# EAGLE schematic shield (EAGLE 6.4)
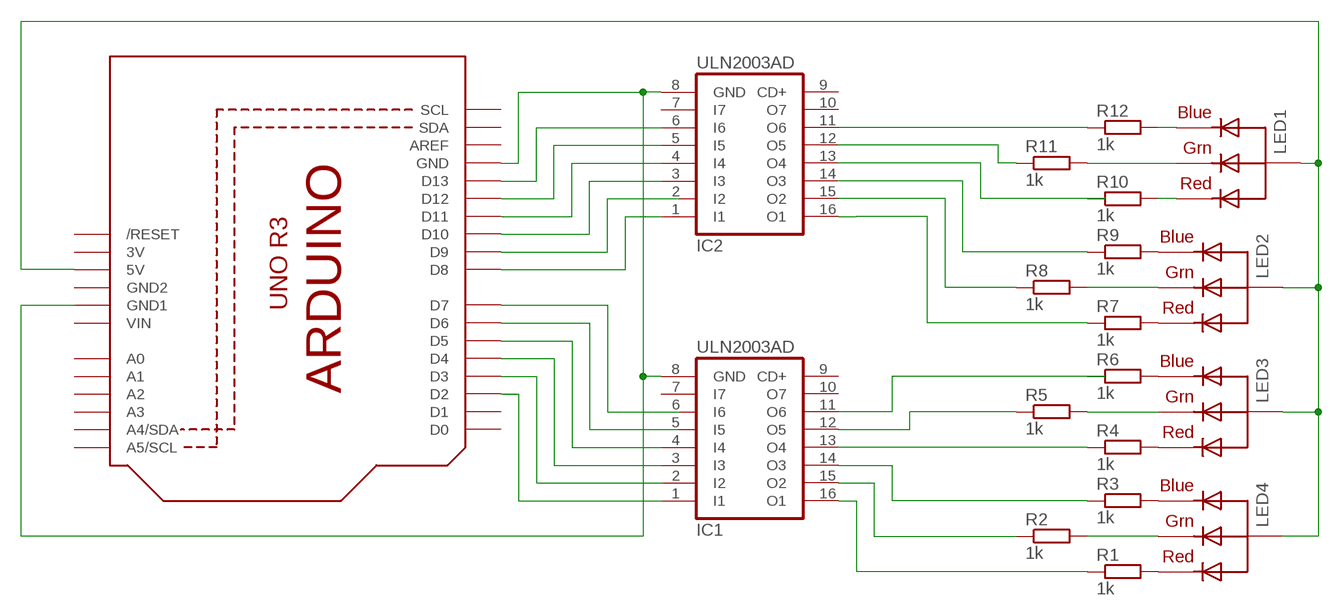
[diagram p0: schematic, sheet 1]

## Parts
IC1  ULN2003AD  [SO16]
IC2  ULN2003AD  [SO16]
LED1  RGBLED_CA-PIRANHA  [PIRANHA5MM]
LED2  RGBLED_CA-PIRANHA  [PIRANHA5MM]
LED3  RGBLED_CA-PIRANHA  [PIRANHA5MM]
LED4  RGBLED_CA-PIRANHA  [PIRANHA5MM]
Q1  ARDUINOR3-NOIOREF-NOTEXT  [ARDUINOR3-NOTEXT-NOIOREF]
R1  1k  R-EU_0204/7  [0204/7]
R2  1k  R-EU_0204/7  [0204/7]
R3  1k  R-EU_0204/7  [0204/7]
R4  1k  R-EU_0204/7  [0204/7]
R5  1k  R-EU_0204/7  [0204/7]
R6  1k  R-EU_0204/7  [0204/7]
R7  1k  R-EU_0204/7  [0204/7]
R8  1k  R-EU_0204/7  [0204/7]
R9  1k  R-EU_0204/7  [0204/7]
R10  1k  R-EU_0204/7  [0204/7]
R11  1k  R-EU_0204/7  [0204/7]
R12  1k  R-EU_0204/7  [0204/7]

## Nets
N$1: IC1.8(GND) IC2.8(GND) Q1.GND Q1.GND1
N$2: LED1.4(VCC) LED2.4(VCC) LED3.4(VCC) LED4.4(VCC) Q1.5V
N$3: LED4.2(RED) R1.2
N$4: LED4.1(BLUE) R3.2
N$5: LED3.3(GREEN) R5.2
N$6: LED2.2(RED) R7.2
N$7: LED2.1(BLUE) R9.2
N$8: LED1.2(RED) R10.2
N$9: LED1.1(BLUE) R12.2
N$10: LED3.1(BLUE) R6.2
N$11: LED3.2(RED) R4.2
N$12: LED2.3(GREEN) R8.2
N$13: LED1.3(GREEN) R11.2
N$14: LED4.3(GREEN) R2.2
N$15: IC1.16(O1) R1.1
N$16: IC1.15(O2) R2.1
N$17: IC1.14(O3) R3.1
N$18: IC1.13(O4) R4.1
N$19: IC1.12(O5) R5.1
N$20: IC1.11(O6)
N$21: IC1.1(I1) Q1.D2
N$22: IC2.12(O5) R11.1
N$23: IC2.13(O4)
N$24: IC2.14(O3) R9.1
N$25: IC2.11(O6) R12.1
N$26: IC2.15(O2) R8.1
N$27: IC2.16(O1) R7.1
N$28: Q1.D4
N$30: IC1.4(I4) Q1.D5
N$31: Q1.D6
N$32: Q1.D7
N$33: IC2.1(I1) Q1.D8
N$34: Q1.D9
N$35: IC2.3(I3) Q1.D10
N$36: IC2.4(I4) Q1.D11
N$37: IC2.5(I5) Q1.D12
N$38: IC2.6(I6) Q1.D13
N$39: IC1.2(I2) Q1.D3
Unconnected: IC1.3(I3) IC1.5(I5) IC1.6(I6) IC1.7(I7) IC1.9(CD+) IC1.10(O7) IC2.2(I2) IC2.7(I7) IC2.9(CD+) IC2.10(O7) Q1.A0 Q1.A1 Q1.A2 Q1.A3 Q1.A4(A4/SDA) Q1.A5(A5/SCL) Q1.AREF Q1.D0 Q1.D1 Q1.RESET(/RESET) Q1.SCL Q1.SDA R6.1 R10.1

## Power pins joined to a net without a drawn wire
3V: Q1.3V
GND2: Q1.GND2
VIN: Q1.VIN

## Library data of the parts
IC1 IC2 = uln-udn:ULN2003A: DRIVER ARRAY
LED1-LED4 = adafruit:RGBLED_CA: RGB LED, common-anode 5MM Staggered pins 5mm Piranha package http://www.ladyada.net/library/pcb/eaglelibrary.html
Q1 = adafruit:ARDUINOR3-NOIOREF
R1-R12 = resistor:R-EU_: RESISTOR, European symbol